# Altium schematic sheet power_supplies.SchDoc
size 558 x 431 mm; SheetNumber: 3; SheetTotal: 4
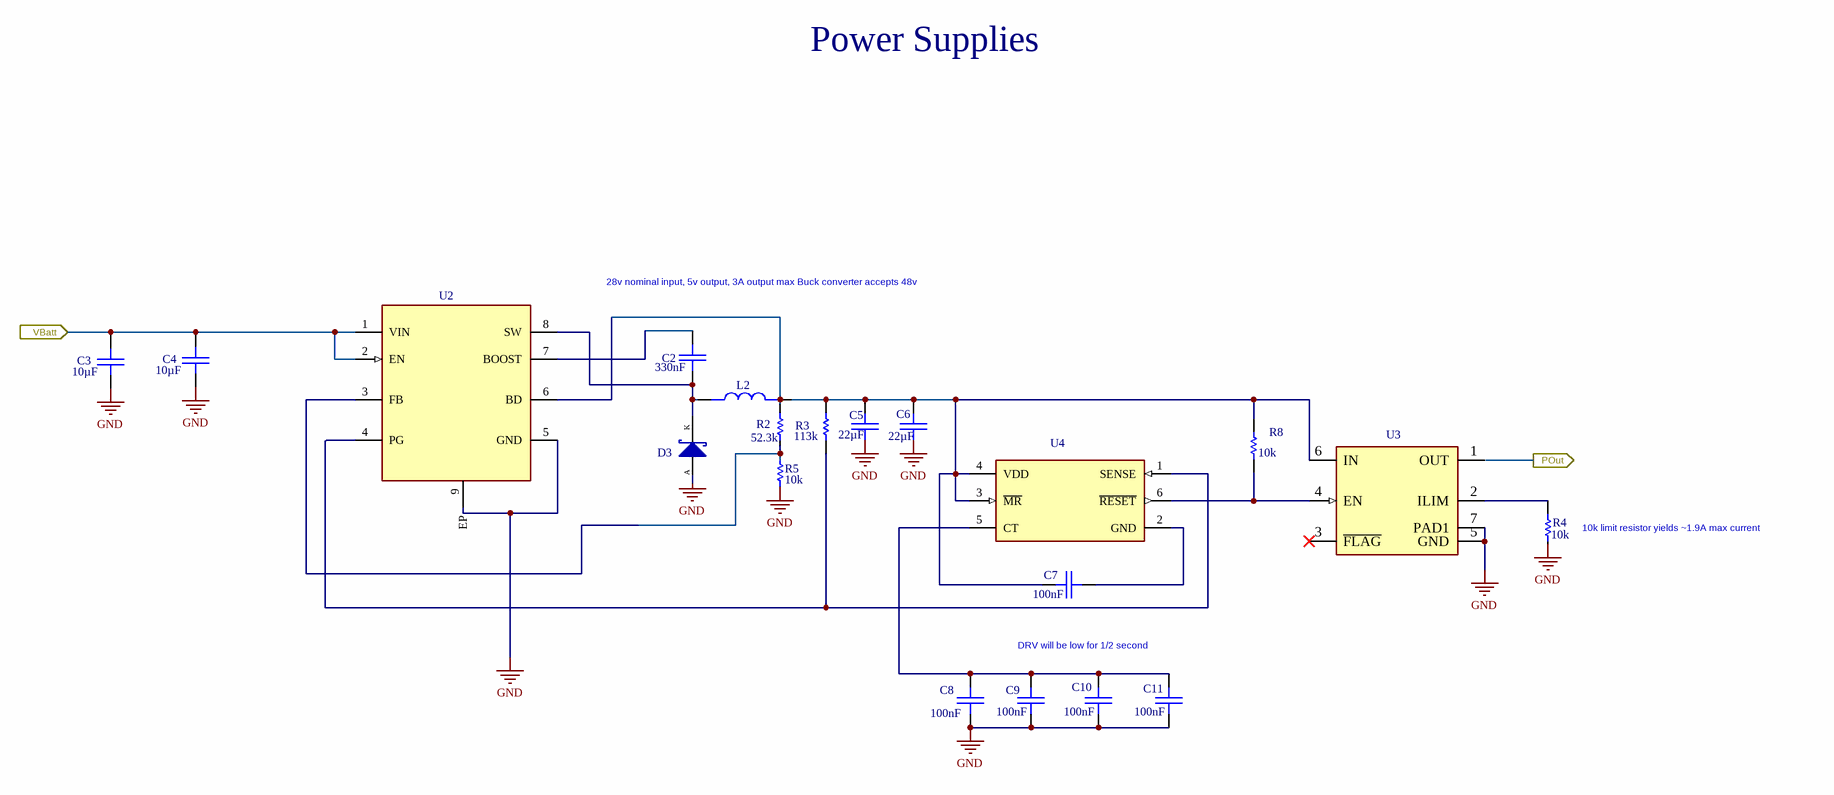
[diagram p0: power_supplies.SchDoc]

## Parts
C2  value 330nF  [CAP-0805-A]  (hidden comment: CAP 0805 0.33uF 50V 10% X7R CER)
C3  value 10µF  [CAP-0805-A]  (hidden comment: CAP 0805 10UF 50V 10% X5R)
C4  value 10µF  [CAP-0805-A]  (hidden comment: CAP 0805 10UF 50V 10% X5R)
C5  value 22µF  [CAP-0805-C]  (hidden comment: CAP 0805 22UF 16V 20% X5R)
C6  value 22µF  [CAP-0805-C]  (hidden comment: CAP 0805 22UF 16V 20% X5R)
C7  value 100nF  [CAP-0402-A]  (hidden comment: Cap 0402 0.1uf 25V 10% X7R)
C8  value 100nF  [CAP-0402-A]  (hidden comment: Cap 0402 0.1uf 25V 10% X7R)
C9  value 100nF  [CAP-0402-A]  (hidden comment: Cap 0402 0.1uf 25V 10% X7R)
C10  value 100nF  [CAP-0402-A]  (hidden comment: Cap 0402 0.1uf 25V 10% X7R)
C11  value 100nF  [CAP-0402-A]  (hidden comment: Cap 0402 0.1uf 25V 10% X7R)
D3  SS3060HE_R1_00001  [DI-SOD123HE-A]  (value not drawn)
L2  5-2176797-4  [IND-1210-A]  (value not drawn)
R2  value 52.3k  [RES-0402-C]  (hidden comment: Res 0402 52.3K 1/10W 1% Thick Flim)
R3  value 113k  [RES-0402-C]  (hidden comment: Res 0402 113K 1/10W 1% Thick Flim)
R4  value 10k  [RES-0402-A]  (hidden comment: RES 0402 10K 1/10W 1%)
R5  value 10k  [RES-0402-A]  (hidden comment: RES 0402 10K 1/10W 1%)
R8  value 10k  [RES-0402-A]  (hidden comment: RES 0402 10K 1/10W 1%)
U2  MCP16361T-E/NMX  [MCP16361T-E/NMX]  (value not drawn)
U3  NCP380HMUAJAAT  [IC-WDFN6-A]  (value not drawn)
U4  16399d4bb0613feb97433aaa3a53e95  [IC-WSON6-A]  (value not drawn)

## Ports
POut (out), VBatt (in)

## Nets
GND: C3.1 C4.1 C8.1 C9.1 C10.1 C11.1 D3.A U2.5(GND) U3.5(GND) U3.7(PAD1)
VBatt: C3.2 C4.2 U2.1(VIN) U2.2(EN) ; port VBatt
NetC2_1: C2.1 D3.K L2.1 U2.8(SW)
NetC2_2: C2.2 U2.7(BOOST)
NetC5_2: C5.2 C6.2 C7.1 L2.2 R3.2 R8.2 U3.6(IN) U4.3(~{MR}) U4.4(VDD)
NetC7_2: C7.2 U4.2(GND)
NetC8_2: C8.2 C9.2 C10.2 C11.2 U4.5(CT)
NetR2_1: R2.1 U2.6(BD)
NetR2_2: R2.2 R5.2 U2.3(FB)
NetR3_1: R3.1 U2.4(PG) U4.1(SENSE)
NetR4_2: R4.2 U3.2(ILIM)
NetR8_1: R8.1 U3.4(EN) U4.6(~{RESET})

Not connected (* = marked no-connect by the designer): C5 1; C6 1; R4 1; R5 1; U2 9(EP); U3 1(OUT) 3(~{FLAG})*

## Notes on the sheet
- Power Supplies
- 28v nominal input, 5v output, 3A output max
  Buck converter accepts 48v
- (near R4) 10k limit resistor yields ~1.9A max current
- DRV will be low for 1/2 second
- Labels drawn without touching a wire or pin: GND
- REVISIONS
- REVISION
- DESCRIPTION
- DATE(YEAR-MO-DA)
- APPROVED
- DWG NO
- SH
- THIS DRAWING IS CAD MAINTAINED.
  CHANGES SHALL BE INCORPORATED
  BY THE DESIGN ACTIVITY.
- PART NO.
- CONTRACT NUMBER
- DESIGN ACTIVITY
- CONTRACTOR
- US ARMY
  COMBAT CAPABILITIES DEVELOPMENT COMMAND ARMAMENTS CENTER
  PICATINNY ARSENAL, NEW JERSEY 07806-5000
- DRAWN BY
- ENGINEER
- CHECKER
- QUALITY ENGINEER
- DRAWING APPROVAL
- SIZE
- CAGE CODE
- DWG NO.
- NEXT ASSY
- USED ON
- DESIGN APPROVAL
- C
- 19200
- APPLICATION
- SCALE
- NONE
- UNIT WT.
- ---
- SHEET

## Library data of the parts
C2 = CAP-00399-2: Leader Qty: 100; UOM: EA; Case/Package: 0805; Max Operating Temperature: 125°C; Min Operating Temperature: -55°C; Mounting Technology: Surface Mount; Voltage Rating: 50V; Tolerance: 10%
C3 C4 = CAP-00370-1: Leader Qty: 100; UOM: EA; Case/Package: 0805; Dielectric: X5R; Max Operating Temperature: 85°C; Min Operating Temperature: -55°C; Mounting Technology: Surface Mount
C5 C6 = CAP-00013-15: Capacitor Type: Ceramic; Leader Qty: 100; UOM: EA; Case/Package: 0805; Max Operating Temperature: 85°C; Min Operating Temperature: -55°C; Mounting Technology: Surface Mount, MLCC; Pins: 2; Voltage Rating: 16V
C7-C11 = CAP-00172-4: Multilayer Ceramic Capacitor, 0.1 uF, 25 V, ± 10%, X7R, 0402 [1005 Metric]; Leader Qty: 100; Case/Package: 0402; Max Operating Temperature: 125°C; Min Operating Temperature: -55°C; Mounting Technology: Surface Mount; Ratings: AEC-Q200; Reach SVHC Compliant: No; RoHS Compliant: Yes; Series: CGA; Termination: SMD/SMT; Voltage: 25V; Voltage Rating (DC): 25V; Voltage Rating: 25V
D3 = CMP-00739-3: DIODE SCHOTTKY 60V 3A SOD123HE; Forward Voltage: 650mV; Max Forward Surge Current (Ifsm): 80A; Number of Elements: 1; Peak Reverse Current: 100µA; Export Control Classification Number (ECCN) Code: EAR99; Harmonized Tariff Schedule (HTS) Code: 8541.10.00.80; Introduction Date: 2012-03-14; Lifecycle Status: Production; Max Operating Temperature: 150°C; Max Output current: 3A; Min Operating Temperature: -55°C; Number of Terminals: 2; REACH SVHC: No; Reverse Standoff Voltage: 60V; RoHS: Compliant
L2 = CMP-00741-1: FIXED IND 2.2UH 3A 72 MOHM SMD; Export Control Classification Number (ECCN) Code: EAR99; Harmonized Tariff Schedule (HTS) Code: 8504.50.80.00; Introduction Date: 2025-08-22; Lifecycle Status: Production; RoHS: Compliant
R2 = RES-00761-2: Leader Qty: 100; UOM: EA; Voltage Rating: 50V; Case/Package: 0402; Max Operating Temperature: 155°C; Min Operating Temperature: -55°C; Mounting Technology: Surface Mount; Tolerance: 1%
R3 = RES-00724-3: Leader Qty: 100; Max Power Dissipation: 63mW; Voltage Rating: 50V; UOM: EA; Case/Package: 0402; Case Code (Imperial): 0402; Case Code (Metric): 1005; Max Operating Temperature: 155°C; Min Operating Temperature: -55°C; Mounting Technology: Surface Mount; Number of Terminals: 2; Packaging: Tape & Reel; Tolerance: 1%
R4 R5 R8 = RES-00803-1: Leader Qty: 100; UOM: EA; Voltage Rating: 75V; Case/Package: 0402; Max Operating Temperature: 155°C; Min Operating Temperature: -55°C; Mounting Technology: Surface Mount
U2 = IC-00466-4: IC BUCK CONVERTER 48V 2MHZ; Manufacturer Lifecycle Status: REL; Max Duty Cycle: 87%; Max Junction Temperature (Tj): 125°C; Min Supply Voltage: 4V; Number of Channels: 1; Output Current: 3A; Switching Frequency: 2.2MHz; Ambient Temperature Range High: 150°C; Country of Assembly: Taiwan; Country of Fabrication: Taiwan; Country of Origin: Taiwan; Export Control Classification Number (ECCN) Code: EAR99; Harmonized Tariff Schedule (HTS) Code: 8542.39.0060; Height: 900µm; HS Code: 8542.39.0090; Introduction Date: 2020-12-15; Lifecycle Status: Production; Max Operating Temperature: 125°C; Max Supply Voltage: 48V; Min Operating Temperature: -40°C; Number of Outputs: 1; Pins: 8; Projected EOL Date: 2044-12-15; RoHS: Compliant; Topology: Buck
U3 = IC-00468-3: Power Distribution Switch, Current-Limiting (Fixed and Adjustable) Adjustable, Enable H; Manufacturer Lifecycle Status: ACTIVE; Current Rating: 2.1A; Interface: On/Off; Max Junction Temperature (Tj): 125°C; Max Power Dissipation: 830mW; Max Supply Voltage: 5.5V; Min Input Voltage: 2.5V; Nominal Supply Current: 90µA; Nominal Supply Voltage (DC): 5V; Number of Channels: 1; Number of Inputs: 2; Output Configuration: High Side; Turn-Off Delay Time: 3ms; Turn-On Delay Time: 4ms; Value: 110mΩ; Ambient Temperature Range High: 85°C; China RoHS: Compliant; Halogen Free: Halogen Free; Height - Seated (Max): 550µm; Height: 550µm; Lead Free: Lead Free; Length: 2mm; Lifecycle Status: Production; Max Operating Temperature: 85°C; Max Output current: 2.1A; Min Operating Temperature: -40°C; Min Supply Voltage: 2.5V; Mounting Technology: Surface Mount; Nominal Supply Voltage: 5.5V; Number of Circuits: 1; Number of Outputs: 1; Number of Terminals: 6; Operating Supply Voltage: 5.5V; Packaging: Cut Tape; Pins: 6; Radiation Hardening: No; REACH SVHC: Yes; RoHS: Compliant; Schedule B: 8542390000; Temperature Grade: Industrial; Terminal Pitch: 650µm; Width: 2mm; Case/Package: WDFN6
U4 = IC-00469-2: Supervisor Open Drain or Open Collector 1 Channel 6-WSON (1.5x1.5); Manufacturer Lifecycle Status: ACTIVE; Max Junction Temperature (Tj): 125°C; Max Supply Voltage: 5.5V; Min Supply Voltage: 1.5V; Number of Outputs: 1; Quiescent Current: 2µA; Height: 800µm; Lead Free: Lead Free; Length: 1.5mm; Lifecycle Status: Production; Max Operating Temperature: 125°C; Min Operating Temperature: -40°C; Number of Voltages Monitored: 1; Pins: 6; RoHS: Compliant; Schedule B: 8542390000, 8542390000; Thickness: 750µm; Width: 1.5mm; Case/Package: WSON6